# Altium schematic sheet LEDboard.SchDoc
size A4; SheetNumber: 1; SheetTotal: 1
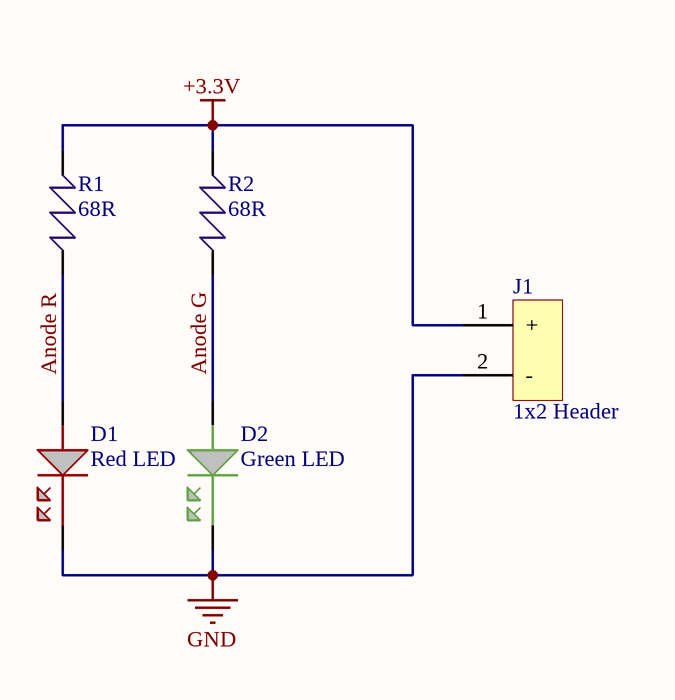
[diagram p0: LEDboard.SchDoc]

## Parts
D1  Red LED  [DIODE_RED]
D2  Green LED  [Diode_Green]
J1  1x2 Header  [Header_2pin]
R1  68R  [R68]
R2  68R  [R68]

## Nets
+3.3V: J1.1(+) R1.1 R2.1
GND: D1.1 D2.1 J1.2(-)
Anode G: D2.2 R2.2
Anode R: D1.2 R1.2

## Library data of the parts
D1 = 150060RS75000: LED Low-Power Uni-Color Red 630nm 2V 2-Pin Chip 0603(1608Metric) T/R; Manufacturer: Wurth Electronics; Lens Color: Colorless; Viewing Angle: 140°; Lens Style: Clear,Flat,Rectangular; Luminous Intensity: 250mcd; Forward Current: 30mA; Wavelength: 625nm; Test Current: 20mA; Lens Transparency: Clear; Max Reverse Voltage (DC): 5V; Power Dissipation: 72mW; Lens Size: 0.7mm; Supplier 1: Digikey; Manufacturer Part Number: 150060RS75000; RoHS: Yes; Category: LEDs; Stock 1: 116083; Pricing 1: 1=0,15, 50=0,142, 100=0,122, 500=0,105, 1000=0,10125 (USD); Mount: Surface Mount; Case/Package: 0603; Color: Red; Case Code (Metric): 1608; Case Code (Imperial): 0603; Min Operating Temperature: -40°C; Max Operating Temperature: 85°C; Package Quantity: 1; Packaging: Cut Tape; Forward Voltage: 2V; Dominant Wavelength: 625nm; Series: WL-SMCW; Reverse Voltage: 5V; Length: 1.6mm; Width: 0.8mm; Height: 0.8mm; RoHS Compliant: Yes; Reach SVHC Compliant: Unknown; ComponentLink1URL: https://datasheet.ciiva.com/29563/150060rs75000-29563040.pdf?src-supplier=Digikey; ComponentLink1Description: https://datasheet.ciiva.com/29563/150060rs75000-29563040.pdf?src-supplier=Digikey; Supplier Part Number 1: 732-4978-1-ND
D2 = 150060VS55040: WL-SMCD SMT Mono-color Chip LED Diffused; Manufacturer: Wurth Electronics; Lens Style: Flat; Luminous Intensity: 60mcd; Forward Voltage: 2V; Test Current: 20mA; Viewing Angle: 140°; Dominant Wavelength: 573nm; Forward Current: 40mA; Max Reverse Voltage (DC): 5V; Power Dissipation: 48mW; Lens Size: 0.8mm; Manufacturer Part Number: 150060VS55040; RoHS: Yes; Category: LEDs; Stock 1: 10387; Pricing 1: 1=0,19, 10=0,173, 100=0,157, 500=0,141, 1000=0,125 (USD); Mount: Surface Mount; Case/Package: 0603; Color: Green; Case Code (Imperial): 0603; Case Code (Metric): 1608; Min Operating Temperature: -40°C; Max Operating Temperature: 85°C; Packaging: Cut Tape; Lens Transparency: Diffused; Series: WL-SMDC; Reverse Voltage: 5V; Wavelength: 573nm; Length: 1.6mm; Width: 0.8mm; Height: 0.5mm; RoHS Compliant: Yes; ComponentLink1URL: http://www.farnell.com/datasheets/2621647.pdf?src-supplier=Farnell; ComponentLink1Description: http://www.farnell.com/datasheets/2621647.pdf?src-supplier=Farnell; ComponentLink2URL: https://www.we-online.de/web/en/index.php/download/media/07_electronic_components/download_center_1/application_notes_berichte/ano002_leds___the_future_of_horticultural_lighting/ANO002b_EN_LEDs_The_Future_of_Horticultural_Lighting.pdf?src-supplier=Digikey; ComponentLink2Description: https://www.we-online.de/web/en/index.php/download/media/07_electronic_components/download_center_1/application_notes_berichte/ano002_leds___the_future_of_horticultural_lighting/ANO002b_EN_LEDs_The_Future_of_Horticultural_Lighting.pdf?src-supplier=Digikey; ComponentLink3URL: https://katalog.we-online.de/pbs/datasheet/150060VS55040.pdf?src-supplier=Digikey; ComponentLink3Description: https://katalog.we-online.de/pbs/datasheet/150060VS55040.pdf?src-supplier=Digikey; ComponentLink4URL: http://www.farnell.com/datasheets/2621647.pdf?src-supplier=Element14; ComponentLink4Description: http://www.farnell.com/datasheets/2621647.pdf?src-supplier=Element14; ComponentLink5URL: http://www.farnell.com/datasheets/2621647.pdf?src-supplier=Newark; ComponentLink5Description: http://www.farnell.com/datasheets/2621647.pdf?src-supplier=Newark; Supplier 1: Digikey; Supplier Part Number 1: 732-12017-1-ND
J1 = 22-29-2021: KK 254 Wire-to-Board Header, Vertical, with Friction Lock, 2 Circuits, Gold (Au) Plating; Manufacturer: Molex; Plating: Tin; Number of Positions: 2; Gender: Male; Voltage Rating (DC): 250V; Glow Wire Compliant: Non-compliant; Manufacturer Part Number: 22-29-2021; RoHS: Yes; Category: Headers and Wire Housings; Stock 1: 124448; Pricing 1: 1=0,34, 10=0,286, 100=0,2225, 3000=0,18654 (USD); Contact Plating: Gold; Contact Material: Tin; Housing Color: Natural; Color: White; Number of Rows: 1; Package Quantity: 24000; Packaging: Bulk; Termination: Through Hole; Series: 6410; Contact Type: -; Halogen Free: Low Halogen; Lead Free: Lead Free; Flammability Rating: UL94 V-0; RoHS Compliant: Yes; Reach SVHC Compliant: Unknown; Supplier 1: Digikey; Supplier Part Number 1: WM2744-ND
R1 R2 = CRCW080568R0FKEAC: SMD Chip Resistor, 68 Ohm, ± 1%, 125 mW, 0805 [2012 Metric], Thick Film, General Purpose; Manufacturer: Vishay; Supplier 1: Digikey; RoHS: Yes; Category: Chip SMD Resistors; Stock 1: 117217; Pricing 1: 1=0,1, 10=0,036, 50=0,0234, 100=0,0197, 500=0,01372, 1000=0,01194 (USD); RoHS Compliant: Yes; Manufacturer Part Number: CRCW080568R0FKEAC; Supplier Part Number 1: 541-CRCW080568R0FKEACCT-ND